# EAGLE design mini-meter-revc (EAGLE 6.5.0)
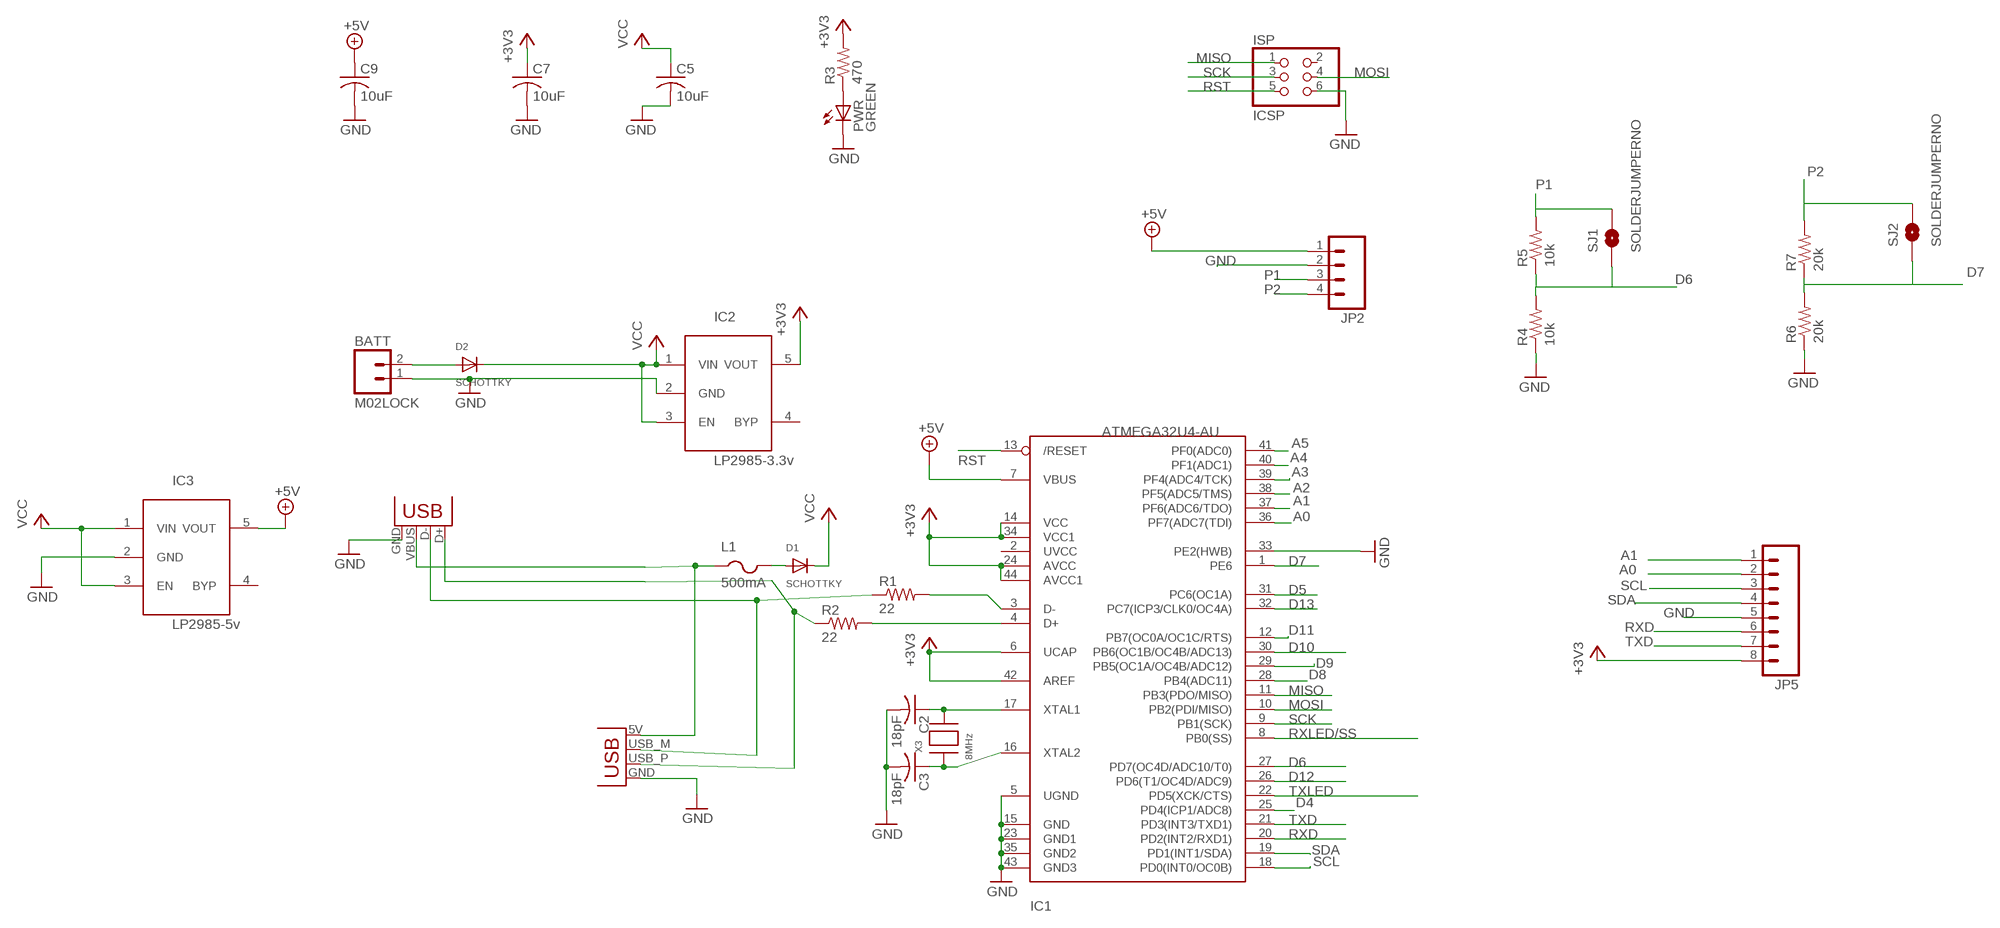
[diagram p0: schematic, sheet 1]

## Parts
BATT  M02LOCK  [1X02_LOCK]
C2  18pF  C-USC0805K  [C0805K]
C3  18pF  C-USC0805K  [C0805K]
C5  10uF  C-USC0805K  [C0805K]
C7  10uF  C-USC0805K  [C0805K]
C9  10uF  C-USC0805K  [C0805K]
D1  SCHOTTKY  DIODESOD-123  [SOD-123]
D2  SCHOTTKY  DIODESOD-123  [SOD-123]
IC1  ATMEGA32U4-AU  [TQFP44]
IC2  LP2985-3.3v  LP298XS  [SOT23-5L]
IC3  LP2985-5v  LP298XS  [SOT23-5L]
ISP  ICSP  PINHD-2X3  [2X03]
JP2  M04LOCK  [1X04_LOCK]
JP5  M08LOCK  [1X08_LOCK]
L1  500mA  PTCFUSE-1206  [R1206]
P1  USBPCB  [USB-A-PCB]
PWR  GREEN  LEDCHIPLED_0805  [CHIPLED_0805]
R1  22  R-US_R0805  [R0805]
R2  22  R-US_R0805  [R0805]
R3  470  R-US_R0805  [R0805]
R4  10k  R-US_R0805  [R0805]
R5  10k  R-US_R0805  [R0805]
R6  20k  R-US_R0805  [R0805]
R7  20k  R-US_R0805  [R0805]
SJ1  SOLDERJUMPERNO  [SJ_2S-NO]
SJ2  SOLDERJUMPERNO  [SJ_2S-NO]
X1  USB-MICROB  [USB-MICROB]
X3  8MHz  XTALNX5032  [NX5032]

## Nets
+3V3: C7.1 IC1.6(UCAP) IC1.14(VCC) IC1.24(AVCC) IC1.34(VCC1) IC1.42(AREF) IC1.44(AVCC1) IC2.5(VOUT) JP5.8 R3.2
+5V: C9.1 IC1.7(VBUS) IC3.5(VOUT) JP2.1
A0: IC1.36(PF7(ADC7(TDI)) JP5.2
A1: IC1.37(PF6(ADC6/TDO)) JP5.1
A2: IC1.38(PF5(ADC5/TMS))
A3: IC1.39(PF4(ADC4/TCK))
A4: IC1.40(PF1(ADC1))
A5: IC1.41(PF0(ADC0))
D4: IC1.25(PD4(ICP1/ADC8))
D5: IC1.31(PC6(OC1A))
D6: IC1.27(PD7(OC4D/ADC10/T0)) R4.2 R5.1 SJ1.1
D7: IC1.1(PE6) R6.2 R7.1 SJ2.1
D8: IC1.28(PB4(ADC11))
D9: IC1.29(PB5(OC1A/OC4B/ADC12))
D10: IC1.30(PB6(OC1B/OC4B/ADC13))
D11: IC1.12(PB7(OC0A/OC1C/RTS))
D12: IC1.26(PD6(T1/OC4D/ADC9))
D13: IC1.32(PC7(ICP3/CLK0/OC4A))
GND: BATT.1 C2.2 C3.2 C5.2 C7.2 C9.2 IC1.5(UGND) IC1.15(GND) IC1.23(GND1) IC1.33(PE2(HWB)) IC1.35(GND2) IC1.43(GND3) IC2.2(GND) IC3.2(GND) ISP.6 JP2.2 JP5.5 P1.GND PWR.C R4.1 R6.1 X1.GND
MISO: IC1.11(PB3(PDO/MISO)) ISP.1
MOSI: IC1.10(PB2(PDI/MISO)) ISP.4
N$1: PWR.A R3.1
N$2: P1.USB_P(D+) R2.1 X1.D+
N$3: IC1.3(D-) R1.2
N$4: IC1.4(D+) R2.2
N$5: P1.USB_M(D-) R1.1 X1.D-
N$7: BATT.2 D2.A
N$8: C2.1 IC1.17(XTAL1) X3.P$2
N$9: C3.1 IC1.16(XTAL2) X3.P$1
N$11: D1.A L1.2
P1: JP2.3 R5.2 SJ1.2
P2: JP2.4 R7.2 SJ2.2
RST: IC1.13(/RESET) ISP.5
RXD: IC1.20(PD2(INT2/RXD1)) JP5.6
RXLED/SS: IC1.8(PB0(SS))
SCK: IC1.9(PB1(SCK)) ISP.3
SCL: IC1.18(PD0(INT0/OC0B)) JP5.3
SDA: IC1.19(PD1(INT1/SDA)) JP5.4
TXD: IC1.21(PD3(INT3/TXD1)) JP5.7
TXLED: IC1.22(PD5(XCK/CTS))
VBUS: L1.1 P1.5V(VBUS) X1.VBUS
VCC: C5.1 D1.C D2.C IC2.1(VIN) IC2.3(EN) IC3.1(VIN) IC3.3(EN)
Unconnected: IC1.2(UVCC) IC2.4(BYP) IC3.4(BYP) ISP.2

## Library data of the parts
BATT = SparkFun-Connectors:M02: Standard 2-pin 0.1" header. Use with - straight break away headers ( PRT-00116) - right angle break away headers (PRT-00553) - swiss pins (PRT-00743) - machine pins (PRT-00117) - female headers (PRT-00115) Molex polarized connector foot print use with: PRT-08233 with associated crimp pins and housings. 2.54_SCREWTERM for use with PRT-10571. 3.5mm Screw Terminal footprints for PRT-08084 5mm Screw Terminal footprints for use with PRT-08433
C2 C3 C5 C7 C9 = adafruit:C-US: CAPACITOR, American symbol
D1 D2 = adafruit:DIODE: Diode SMADIODE - SMA Surface Mount Package 20V 1A Schottky Diode Digikey: 641-1014-6-ND DO-1N4148 - Through Hole Small Current Diode SOD-123 20V 1 A (.5mV Vf) Schottky Diode - Digikey: MBRX120TPMSCT-ND SOD-323 10V 570mA (.38mV Vf, 3ns) Schottky Diode - Digikey: ZLLS410CT-ND SOD-523 30V 30mA Schottky Diode (RB751S-40TE61) - Digikey: RB751S-40TE61CT-ND SOT23-R/W - SOT23 Package (R = Solder Paste/Reflow Ovens, W = Hand-Soldering) BAT54Film 40V 300mA - Digikey: 497-7162-1-ND
IC1 = adaprog:ATMEGA32U4
IC2 IC3 = adafruit:LP298X
ISP = pinhead:PINHD-2X3: PIN HEADER
JP2 = SparkFun-Connectors:M04: Header 4 Standard 4-pin 0.1" header. Use with straight break away headers (SKU : PRT-00116), right angle break away headers (PRT-00553), swiss pins (PRT-00743), machine pins (PRT-00117), and female headers (PRT-00115). Molex polarized connector foot print use with SKU : PRT-08231 with associated crimp pins and housings. 1MM SMD Version SKU: PRT-10208
JP5 = SparkFun-Connectors:M08: Header 8 Standard 8-pin 0.1" header. Use with straight break away headers (SKU : PRT-00116), right angle break away headers (PRT-00553), swiss pins (PRT-00743), machine pins (PRT-00117), and female headers (PRT-00115).
L1 = adafruit:PTCFUSE: PTC fuses, resettable thermistors
P1 = freetronics-master-v1:USB: USB Connectors USB-B-PTH is fully proven SKU : PRT-00139 USB-miniB is fully proven SKU : PRT-00587 USB-A-PCB is untested. USB-A-H is throughly reviewed, but untested. Spark Fun Electronics SKU : PRT-00437 USB-B-SMT is throughly reviewed, but untested. Needs silkscreen touching up. USB-A-S has not been used/tested USB-MB-H has not been used/tested
PWR = adafruit:LED: LED OSRAM: - CHIPLED LG R971, LG N971, LY N971, LG Q971, LY Q971, LO R971, LY R971 LH N974, LH R974 LS Q976, LO Q976, LY Q976 LO Q996 - Hyper CHIPLED LW Q18S LB Q993, LB Q99A, LB R99A - SideLED LS A670, LO A670, LY A670, LG A670, LP A670 LB A673, LV A673, LT A673, LW A673 LH A674 LY A675 LS A676, LA A676, LO A676, LY A676, LW A676 LS A679, LY A679, LG A679 - Hyper Micro SIDELED® LS Y876, LA Y876, LO Y876, LY Y876 LT Y87S - SmartLED LW L88C, LW L88S LB L89C, LB L89S, LG L890 LS L89K, LO L89K, LY L89K LS L896, LA L896, LO L896, LY L896 - TOPLED LS T670, LO T670, LY T670, LG T670, LP T670 LSG T670, LSP T670, LSY T670, LOP T670, LYG T670 LG T671, LOG T671, LSG T671 LB T673, LV T673, LT T673, LW T673 LH T674 LS T676, LA T676, LO T676, LY T676, LB T676, LH T676, LSB T676, LW T676 LB T67C, LV T67C, LT T67C, LS T67K, LO T67K, LY T67K, LW E67C LS E67B, LA E67B, LO E67B, LY E67B, LB E67C, LV E67C, LT E67C LW T67C LS T679, LY T679, LG T679 LS T770, LO T770, LY T770, LG T770, LP T770 LB T773, LV T773, LT T773, LW T773 LH T774 LS E675, LA E675, LY E675, LS T675 LS T776, LA T776, LO T776, LY T776, LB T776 LHGB T686 LT T68C, LB T68C - Hyper Mini TOPLED® LB M676 - Mini TOPLED Santana® LG M470 LS M47K, LO M47K, LY M47K Source: http://www.osram.convergy.de/
R1-R7 = adafruit:R-US_: RESISTOR, American symbol
SJ1 SJ2 = SparkFun-Passives:SOLDERJUMPER: Solder Jumper Standard SMD solder jumper. Used to automate production. Two varients : Normally Open and Normally Closed are the same, but have different paste layers. NC will have a large amount of paste and should jumper during reflow.
X1 = SparkFun:USB: USB Connectors USB-B-PTH is fully proven SKU : PRT-00139 USB-miniB is fully proven SKU : PRT-00587 USB-A-PCB is untested. USB-A-H is throughly reviewed, but untested. Spark Fun Electronics SKU : PRT-00437 USB-B-SMT is throughly reviewed, but untested. Needs silkscreen touching up. USB-A-S has not been used/tested USB-MB-H has not been used/tested
X3 = adaprog:XTAL

## Net classes
0 default: width 0.152 mm, drill 0.241 mm, clearance 0.152 mm

## Board
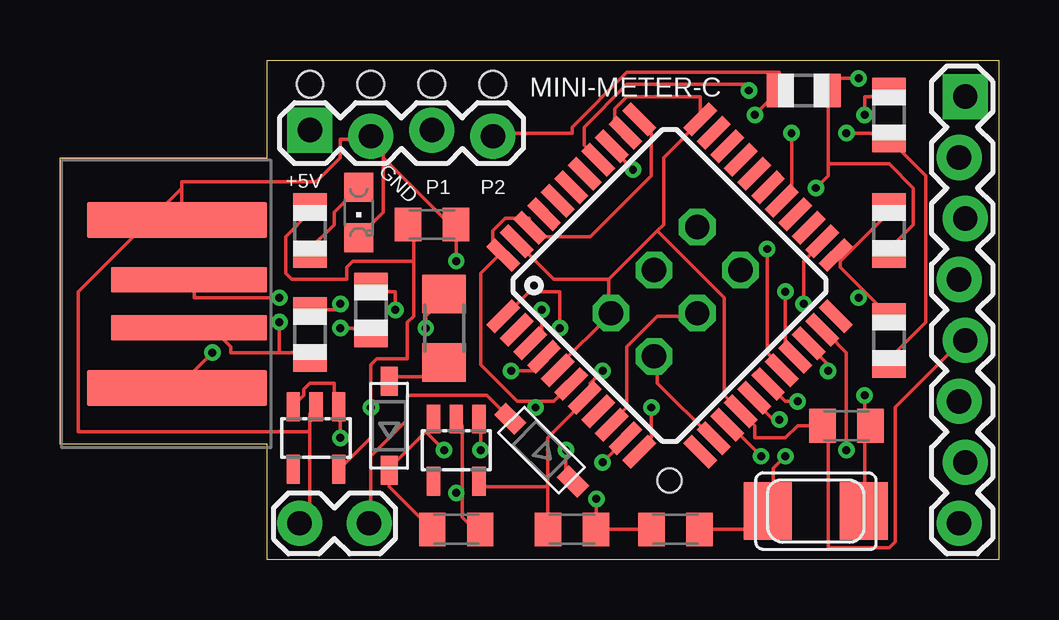
[diagram p1: board, top side]
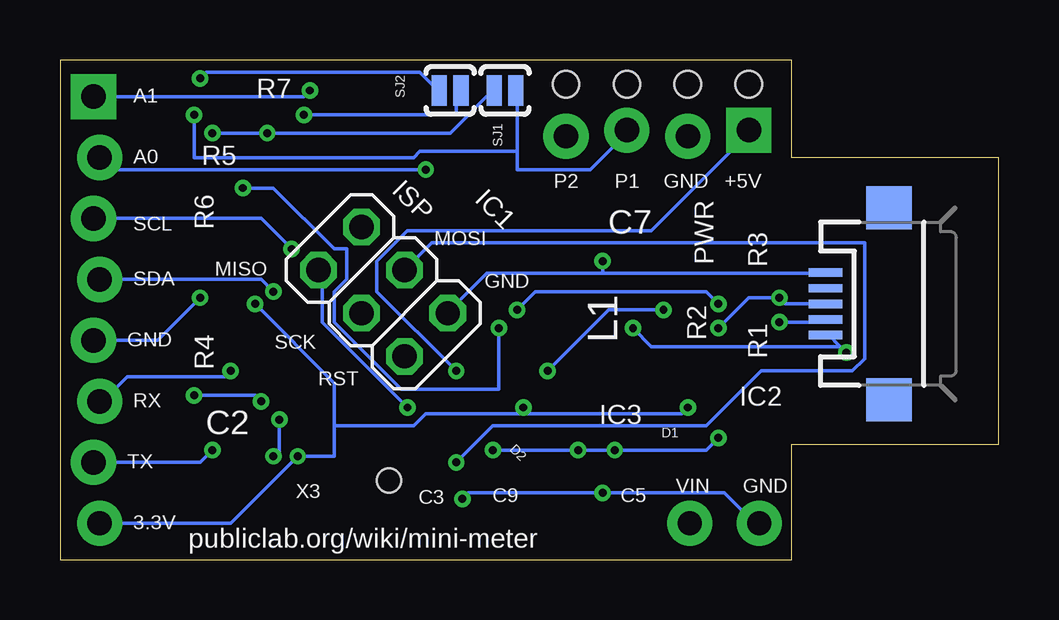
[diagram p2: board, bottom side, seen from below]

Size 39.12 x 20.83 mm. Coordinates in mm from the lower left corner, seen from the top.
Outline: 0,16.76 8.64,16.76 8.64,20.83 39.12,20.83 39.12,0 8.64,0 8.64,4.83 0,4.83 0,16.76
Copper layers (1*16): Top 0.0356mm / dielectric 1.5011mm / Bottom 0.0356mm
Design rules "LaenPCBOrder": minimum track width 6mil, minimum drill 13mil, track to track 6mil, track to pad 6mil, pad to pad 6mil, via to via 6mil, smd to smd 6mil, copper to edge 15mil, drill to drill 6mil, minimum pad ring 7mil, minimum via ring 7mil, stop-mask expansion 3mil, vias tented up to drill 0mil, thermal gap 10mil
Holes 1.1 mm at 10.41,19.81 12.95,19.81 15.49,19.81 18.03,19.81
Holes 1 mm at 25.4,3.3

### Footprints (pad centres in the part's own frame; a part is rotated, then mirrored left to right if it is on the bottom)
1X02_LOCK = drill 1.016 pad 1.88: 1 -0.178,0; 2 2.718,0
C0805K = smd 1.1 x 1.4: 1 -1,0; 2 1,0
SOD-123 = smd 1.2 x 0.7: A 1.85,0; C -1.85,0
TQFP44 = smd 1.5 x 0.5: 1 -5.8,4; 2 -5.8,3.2; 3 -5.8,2.4; 4 -5.8,1.6; 5 -5.8,0.8; 6 -5.8,0; 7 -5.8,-0.8; 8 -5.8,-1.6; 9 -5.8,-2.4; 10 -5.8,-3.2; 11 -5.8,-4; 23 5.8,-4; 24 5.8,-3.2; 25 5.8,-2.4; 26 5.8,-1.6; 27 5.8,-0.8; 28 5.8,0; 29 5.8,0.8; 30 5.8,1.6; 31 5.8,2.4; 32 5.8,3.2; 33 5.8,4 | smd 0.5 x 1.5: 12 -4,-5.8; 13 -3.2,-5.8; 14 -2.4,-5.8; 15 -1.6,-5.8; 16 -0.8,-5.8; 17 0,-5.8; 18 0.8,-5.8; 19 1.6,-5.8; 20 2.4,-5.8; 21 3.2,-5.8; 22 4,-5.8; 34 4,5.8; 35 3.2,5.8; 36 2.4,5.8; 37 1.6,5.8; 38 0.8,5.8; 39 0,5.8; 40 -0.8,5.8; 41 -1.6,5.8; 42 -2.4,5.8; 43 -3.2,5.8; 44 -4,5.8
SOT23-5L = smd 0.55 x 1.2: 1 -0.95,-1.3; 2 0,-1.3; 3 0.95,-1.3; 4 0.95,1.3; 5 -0.95,1.3
2X03 = drill 1.016 octagon: 1 -2.54,-1.27; 2 -2.54,1.27; 3 0,-1.27; 4 0,1.27; 5 2.54,-1.27; 6 2.54,1.27
1X04_LOCK = drill 1.016 pad 1.88 square: 1 0,0.127 | drill 1.016 pad 1.88: 2 2.54,-0.127; 3 5.08,0.127; 4 7.62,-0.127
1X08_LOCK = drill 1.016 pad 1.88 square: 1 0,0.127 | drill 1.016 pad 1.88: 2 2.54,-0.127; 3 5.08,0.127; 4 7.62,-0.127; 5 10.16,0.127; 6 12.7,-0.127; 7 15.24,0.127; 8 17.78,-0.127
R1206 = smd 1.6 x 1.803: 1 -1.422,0; 2 1.422,0
USB-A-PCB = smd 7.5 x 1.5: 5V -0.2,-3.5; GND -0.2,3.5 | smd 6.5 x 1.067: USB_M 0.3,-1; USB_P 0.3,1
CHIPLED_0805 = smd 1.2 x 1.2: A 0,-1.05; C 0,1.05
R0805 = smd 1.1 x 1.4: 1 -1,0; 2 1,0
SJ_2S-NO = smd 0.635 x 1.27: 1 -0.45,0; 2 0.45,0
USB-MICROB = smd 0.35 x 1.4: D+ 0,2.65; D- -0.65,2.65; GND 1.3,2.65; ID 0.65,2.65; VBUS -1.3,2.65 | smd 1.8 x 1.9: MT1 -4,0; MT2 4,0
NX5032 = smd 2 x 2.4: P$1 2,0; P$2 -2,0

### Placement (x,y rotation side)
BATT  10.16,1.52 0 top
C2  32.77,5.59 180 top
C3  25.65,1.27 180 top
C5  16.51,1.27 0 top
C7  15.49,13.97 0 top
C9  21.34,1.27 0 top
D1  13.72,5.59 90 top
D2  20.07,4.57 135 top
IC1  25.4,11.43 45 top
IC2  10.67,5.08 180 top
IC3  16.51,4.57 180 top
ISP  25.65,11.18 315 bottom
JP2  10.41,17.78 0 top
JP5  37.59,19.3 270 top
L1  16,9.65 270 top
P1  5.08,10.67 0 top
PWR  12.45,14.48 180 top
R1  10.41,9.4 90 top
R2  12.95,10.41 90 top
R3  10.41,13.72 90 top
R4  34.54,9.14 270 top
R5  34.54,18.54 90 top
R6  34.54,13.72 270 top
R7  30.99,19.56 180 top
SJ1  20.57,19.56 0 bottom
SJ2  22.86,19.56 0 bottom
X1  4.57,10.67 90 bottom
X3  31.5,2.03 180 top

### Tracks (layer width: path | path; a pad name or v marks a point on that pad's centre or on a via)
+3V3  (via drill 0.33)
  Top 0.152: IC1.6 20.57,6.6 19.81,6.6 | 19.81,6.6 19.05,6.6 17.53,8.13 17.53,11.94 18.29,12.7 IC1.44 18.29,12.95 18.03,13.21 18.03,13.72 18.54,14.22 19.56,14.22 19.56,13.97 IC1.42 19.81,13.72 19.81,13.46 22.1,13.46 24.64,16 24.64,17.78 24.13,18.29 IC1.34 | 14.73,12.45 14.73,13.97 C7.1 | 14.73,12.45 14.73,10.16 14.48,9.91 14.48,8.38 13.21,8.38 12.95,8.13 v12.95,6.35 12.95,5.08 11.68,3.81 IC2.5 | 14.73,12.45 12.19,12.45 11.94,12.19 11.94,11.68 9.65,11.68 9.4,11.94 9.4,13.46 10.41,14.48 R3.2 | v29.21,4.32 27.94,5.59 IC1.14 | v30.99,10.67 30.99,12.45 31.75,13.21 IC1.24 | v19.81,6.35 19.81,6.6
  Bottom 0.152: JP5.8 32,1.52 v29.21,4.32 27.69,4.32 27.69,5.59 | v30.99,10.67 27.69,7.37 27.69,5.59 | v12.95,6.35 13.21,6.1 19.81,6.1 | 19.81,6.1 23.88,6.1 24.38,5.59 27.69,5.59 | 19.81,6.1 v19.81,6.35
+5V  (via drill 0.33)
  Top 0.152: 20.32,3.05 17.53,3.05 IC3.5 | 20.32,3.05 20.32,1.27 C9.1 | 20.32,3.05 20.32,5.08 21.84,6.6 IC1.7 22.1,6.86 22.1,7.37 v22.61,7.87
  Bottom 0.152: v22.61,7.87 25.91,11.18 25.91,12.45 24.64,13.72 14.48,13.72 10.41,17.78 JP2.1
A0  (via drill 0.33)
  Top 0.152: v23.88,16.26 23.11,17.02 IC1.36
  Bottom 0.152: v23.88,16.26 36.83,16.26 37.34,16.76 JP5.2
A1  (via drill 0.33)
  Top 0.152: v28.7,19.56 28.7,19.81 23.62,19.81 21.84,18.03 21.84,17.27 22.35,16.76 IC1.37
  Bottom 0.152: v28.7,19.56 28.96,19.3 JP5.1
D6  (via drill 0.33)
  Top 0.152: v32.77,17.78 34.54,17.78 R5.1 34.54,17.53 36.07,16 36.07,9.91 34.54,8.38 R4.2 | v30.48,17.78 30.48,15.24 30.23,14.99 IC1.27
  Bottom 0.152: v32.77,17.78 v30.48,17.78 22.86,17.78 21.08,19.56 SJ1.1
D7  (via drill 0.33)
  Top 0.152: v33.27,20.07 32,20.07 32,19.56 | 32,16.51 34.54,16.51 35.56,15.49 35.56,13.97 34.54,12.95 R6.2 | 32,19.56 32,16.51 | 32,19.56 R7.1 | v20.83,9.65 20.83,11.18 19.56,11.18 18.54,10.16 IC1.1 | v31.5,15.49 32,16 32,16.51
  Bottom 0.152: v33.27,20.07 33.02,20.32 24.13,20.32 23.37,19.56 SJ2.1 | v20.83,9.65 20.83,7.11 24.89,7.11 27.69,9.91 27.69,11.18 27.18,11.68 27.18,12.95 27.69,12.95 30.23,15.49 v31.5,15.49
GND  (via drill 0.33)
  Top 0.152: 16.76,2.79 16.76,1.78 17.27,1.27 C5.2 | 16.76,2.79 16.76,5.59 16.51,5.84 IC3.2 | C3.2 22.35,1.27 | 10.41,5.33 10.41,1.78 10.16,1.52 BATT.1 | 10.41,5.33 10.41,6.1 10.67,6.35 IC2.2 | v22.35,2.54 22.35,1.27 | 22.35,1.27 C9.2 | v16.51,2.79 16.76,2.79 | 13.46,16.76 13.46,17.02 12.95,17.53 | 13.46,16.76 13.46,14.48 12.45,13.46 PWR.C | 13.46,16.76 16.26,13.97 C7.2 16.51,13.97 v16.51,12.45 | 12.95,17.53 11.68,17.53 11.68,16.76 10.67,15.75 5.08,15.75 5.08,15.49 | 5.08,15.49 5.08,14.22 P1.GND | 12.95,17.53 JP2.2 | 10.41,5.33 0.76,5.33 0.76,11.18 5.08,15.49 | 33.53,11.18 32.51,12.19 32.51,12.45 | 33.53,11.18 34.54,10.16 R4.1 | 32.51,12.45 32.51,12.7 IC1.23 | 32.51,12.45 34.54,14.48 R6.1 | v33.27,10.92 33.53,11.18 | IC1.35 23.37,18.03 23.11,18.29 23.11,18.8 23.62,19.3 26.67,19.3 26.67,18.54 IC1.33 26.67,18.29 25.15,16.76 25.15,13.97 24.89,13.72 | IC1.5 20.83,8.13 22.86,10.16 ISP.6 22.86,10.41 22.86,11.68 | 22.86,11.68 20.57,11.68 19.05,13.21 IC1.43 | 22.86,11.68 24.89,13.72 | 24.89,13.72 27.69,10.92 27.69,6.86 28.19,6.35 IC1.15 28.45,6.1 28.96,5.59 28.96,5.08 30.23,5.08 30.73,5.59 C2.2 32,5.59 32,0.51 34.54,0.51 34.8,0.76 34.8,6.35 37.59,9.14 JP5.5
  Bottom 0.152: v22.35,2.54 22.1,2.79 v16.51,2.79 11.43,2.79 10.16,1.52 BATT.1 | v33.27,10.92 35.05,9.14 JP5.5 | 16.51,11.94 21.34,11.94 22.86,10.41 ISP.6 | 16.51,11.94 7.37,11.94 X1.GND | 16.51,11.94 v16.51,12.45
MISO  (via drill 0.33)
  Top 0.152: v24.64,6.35 24.64,5.08 24.13,4.57 IC1.11
  Bottom 0.152: v24.64,6.35 28.19,9.91 28.19,11.94 ISP.1
MOSI  (via drill 0.33)
  Top 0.152: v22.61,4.06 23.37,4.83 IC1.10
  Bottom 0.152: v22.61,4.06 21.08,5.59 12.19,5.59 9.91,7.87 6.1,7.87 5.59,8.38 5.59,13.21 23.62,13.21 ISP.4
N$1
  Top 0.152: PWR.A 12.45,15.49 11.43,14.48 11.43,13.97 10.41,12.95 R3.1
N$2  (via drill 0.33)
  Top 0.152: v9.14,10.92 5.59,10.92 5.59,11.43 P1.USB_P | v11.68,9.65 12.95,9.65 R2.1
  Bottom 0.152: X1.D+ 8.89,10.67 v9.14,10.92 10.41,10.92 v11.68,9.65
N$3  (via drill 0.33)
  Top 0.152: v11.68,10.67 11.68,10.41 10.41,10.41 R1.2 | v20.07,10.41 20.07,9.4 19.81,9.14 IC1.3
  Bottom 0.152: v11.68,10.67 12.19,11.18 19.3,11.18 v20.07,10.41
N$4  (via drill 0.33)
  Top 0.152: v13.97,10.41 13.97,11.18 12.95,11.18 R2.2 | v18.8,7.87 19.81,7.87 19.81,8.13 20.07,8.38 IC1.4
  Bottom 0.152: v13.97,10.41 16.26,10.41 v18.8,7.87
N$5  (via drill 0.33)
  Top 0.152: 9.14,8.64 7.11,8.64 7.11,8.89 6.35,9.65 5.59,9.65 P1.USB_M | 9.14,8.64 10.41,8.64 R1.1 | 9.14,8.64 v9.14,9.91
  Bottom 0.152: v9.14,9.91 7.37,9.91 X1.D-
N$7
  Top 0.152: D2.A 18.54,6.1 17.78,6.86 14.48,6.86 14.48,5.84 12.95,4.32 12.95,1.52 BATT.2
N$8  (via drill 0.33)
  Top 0.152: 33.53,5.59 33.53,2.03 X3.P$2 | v30.73,6.6 30.23,6.6 29.72,7.11 IC1.17 | 33.53,5.59 v33.53,6.86 | 33.53,5.59 C2.1
  Bottom 0.152: v30.73,6.6 30.99,6.86 v33.53,6.86
N$9  (via drill 0.33)
  Top 0.152: C3.1 29.46,1.27 29.46,2.03 X3.P$1 29.72,2.03 29.72,3.81 v30.23,4.32 | v29.97,5.84 29.72,5.84 28.96,6.6 IC1.16
  Bottom 0.152: v29.97,5.84 29.97,4.32 v30.23,4.32
N$11
  Top 0.152: L1.2 16,7.62 13.72,7.62 D1.A
P1  (via drill 0.33)
  Top 0.152: v33.53,18.54 33.53,19.3 34.54,19.3 R5.2
  Bottom 0.152: 20.07,17.02 20.07,16.26 17.02,16.26 15.49,17.78 JP2.3 | 20.07,17.02 20.07,19.56 SJ1.2 | v33.53,18.54 33.53,16.76 24.38,16.76 24.13,17.02 20.07,17.02
P2  (via drill 0.33)
  Top 0.152: 29.97,19.56 v28.96,18.54 | 29.97,19.56 29.97,20.32 23.62,20.32 21.34,18.03 21.34,17.78 18.03,17.78 JP2.4 | 29.97,19.56 R7.2
  Bottom 0.152: v28.96,18.54 22.61,18.54 22.61,19.56 SJ2.2
RST
  Top 0.152: IC1.13 27.18,5.08 24.89,7.37 24.89,8.38 ISP.5
RXD  (via drill 0.33)
  Top 0.152: v32,7.87 32,8.13 31.24,8.89 IC1.20
  Bottom 0.152: v32,7.87 32.26,7.62 36.32,7.62 37.34,6.6 JP5.6
SCK
  Top 0.152: IC1.9 23.11,5.84 23.62,6.35 23.62,8.89 24.89,10.16 26.42,10.16 ISP.3
SCL  (via drill 0.33)
  Top 0.152: v29.46,12.95 29.46,8.64 29.97,8.13 IC1.18
  Bottom 0.152: v29.46,12.95 30.73,14.22 JP5.3
SDA  (via drill 0.33)
  Top 0.152: v30.23,11.18 30.23,8.89 30.48,8.64 IC1.19
  Bottom 0.152: v30.23,11.18 30.73,11.68 JP5.4
TXD  (via drill 0.33)
  Top 0.152: v32.77,4.57 32.77,8.64 32,9.4 IC1.21
  Bottom 0.152: v32.77,4.57 33.27,4.06 JP5.7
VBUS  (via drill 0.33)
  Top 0.152: v6.35,8.64 5.08,7.37 P1.5V | v15.24,9.65 15.24,10.16 16,10.92 L1.1
  Bottom 0.152: v6.35,8.64 6.6,8.89 | 6.6,8.89 7.11,9.4 X1.VBUS | v15.24,9.65 14.48,8.89 6.6,8.89
VCC  (via drill 0.33)
  Top 0.152: IC2.3 9.91,6.6 10.16,6.86 10.16,7.11 10.41,7.37 11.43,7.37 11.43,6.6 IC2.1 11.68,6.35 v11.68,5.08 | 15.24,5.33 15.49,5.59 15.49,5.84 IC3.3 | 15.24,5.33 13.72,3.81 D1.C 13.72,3.05 15.49,1.27 C5.1 | v17.53,4.57 17.53,5.84 IC3.1 | 15.24,5.33 v16,4.57 | v21.08,4.57 21.08,3.56 21.34,3.3 D2.C
  Bottom 0.152: v21.08,4.57 v17.53,4.57 v16,4.57 12.19,4.57 v11.68,5.08

### Text on the board
tNames: MINI-METER-C | +5V | GND | P1 | P2
bNames: A1 | A0 | +5V | GND | P1 | P2 | MOSI | SCL | MISO | GND | SDA | SCK | GND | RST | RX | TX | GND | VIN | 3.3V | publiclab.org/wiki/mini-meter